# EAGLE design cryoShieldBreakout (EAGLE 7.1.0)
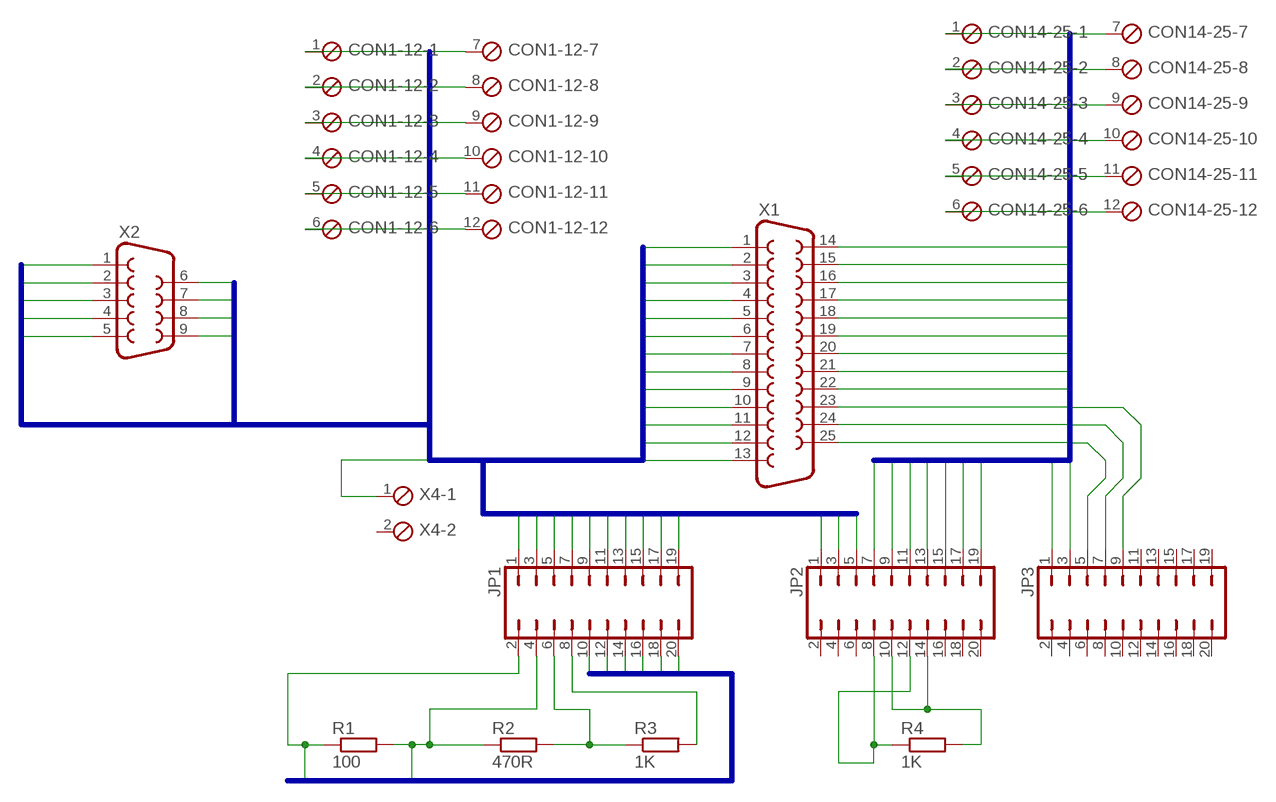
[diagram p0: schematic, sheet 1]

## Parts
CON1-12  MPT12  [12POL254]
CON14-25  MPT12  [12POL254]
JP1  JP10Q  [JP10Q]
JP2  JP10Q  [JP10Q]
JP3  JP10Q  [JP10Q]
R1  100  R-EU_0207/10  [0207/10]
R2  470R  R-EU_0207/10  [0207/10]
R3  1K  R-EU_0207/10  [0207/10]
R4  1K  R-EU_0207/10  [0207/10]
X1  F25H  [F25H]
X2  F09H  [F09H]
X4  MPT2  [2POL254]

## Nets
1: CON1-12.1 JP1.1 X1.1 X2.1
2: CON1-12.2 JP1.3 X1.2 X2.2
3: CON1-12.3 JP1.5 X1.3 X2.3
4: CON1-12.4 JP1.7 X1.4 X2.4
5: CON1-12.5 JP1.9 X1.5 X2.5
6: CON1-12.6 JP1.11 X1.6 X2.6
7: CON1-12.7 JP1.13 X1.7 X2.7
8: CON1-12.8 JP1.15 X1.8 X2.8
9: CON1-12.9 JP1.17 X1.9 X2.9
10: CON1-12.10 JP1.19 X1.10
11: CON1-12.11 JP2.1 X1.11
12: CON1-12.12 JP2.3 X1.12
13: JP2.5 X1.13 X4.1
14: CON14-25.1 JP2.7 X1.14
15: CON14-25.2 JP2.9 X1.15
16: CON14-25.3 JP2.11 X1.16
17: CON14-25.4 JP2.13 X1.17
18: CON14-25.5 JP2.15 X1.18
19: CON14-25.6 JP2.17 X1.19
20: CON14-25.7 JP2.19 X1.20
21: CON14-25.8 JP3.1 X1.21
22: CON14-25.9 JP3.3 X1.22
23: CON14-25.10 JP3.5 X1.23
24: CON14-25.11 JP3.7 X1.24
25: CON14-25.12 JP3.9 X1.25
A1+: JP1.2 JP1.10 R1.1
A1-: JP1.4 R1.2 R2.1
A2+: JP1.12 JP1.14
A3+: JP1.16 JP1.18
A3-: JP1.20
N$2: JP2.8 JP2.12 R4.1
N$3: JP2.10 JP2.14 R4.2
N$6: JP1.6 R2.2 R3.1
N$8: JP1.8 R3.2
Unconnected: JP2.2 JP2.4 JP2.6 JP2.16 JP2.18 JP2.20 JP3.2 JP3.4 JP3.6 JP3.8 JP3.10 JP3.11 JP3.12 JP3.13 JP3.14 JP3.15 JP3.16 JP3.17 JP3.18 JP3.19 JP3.20 X4.2

## Buses
1,2,3,4,5,6,7,8,9,10,11,12,13
14,15,16,17,18,19,20,21,22,23,24,25
A1+,A2+,A3+,A3-

## Library data of the parts
CON1-12 CON14-25 = con-phoenix-254:MPT12: PHOENIX CONNECTOR; OC_FARNELL: unknown; OC_NEWARK: unknown
JP1-JP3 = jumper:JP10Q: JUMPER
R1-R4 = rcl:R-EU_: RESISTOR, European symbol
X1 = con-subd:F25: SUB-D; OC_FARNELL: unknown; OC_NEWARK: unknown
X2 = con-subd:F09: SUB-D; OC_FARNELL: unknown; OC_NEWARK: unknown
X4 = con-phoenix-254:MPT2: PHOENIX CONNECTOR; OC_FARNELL: unknown; OC_NEWARK: unknown

## Board
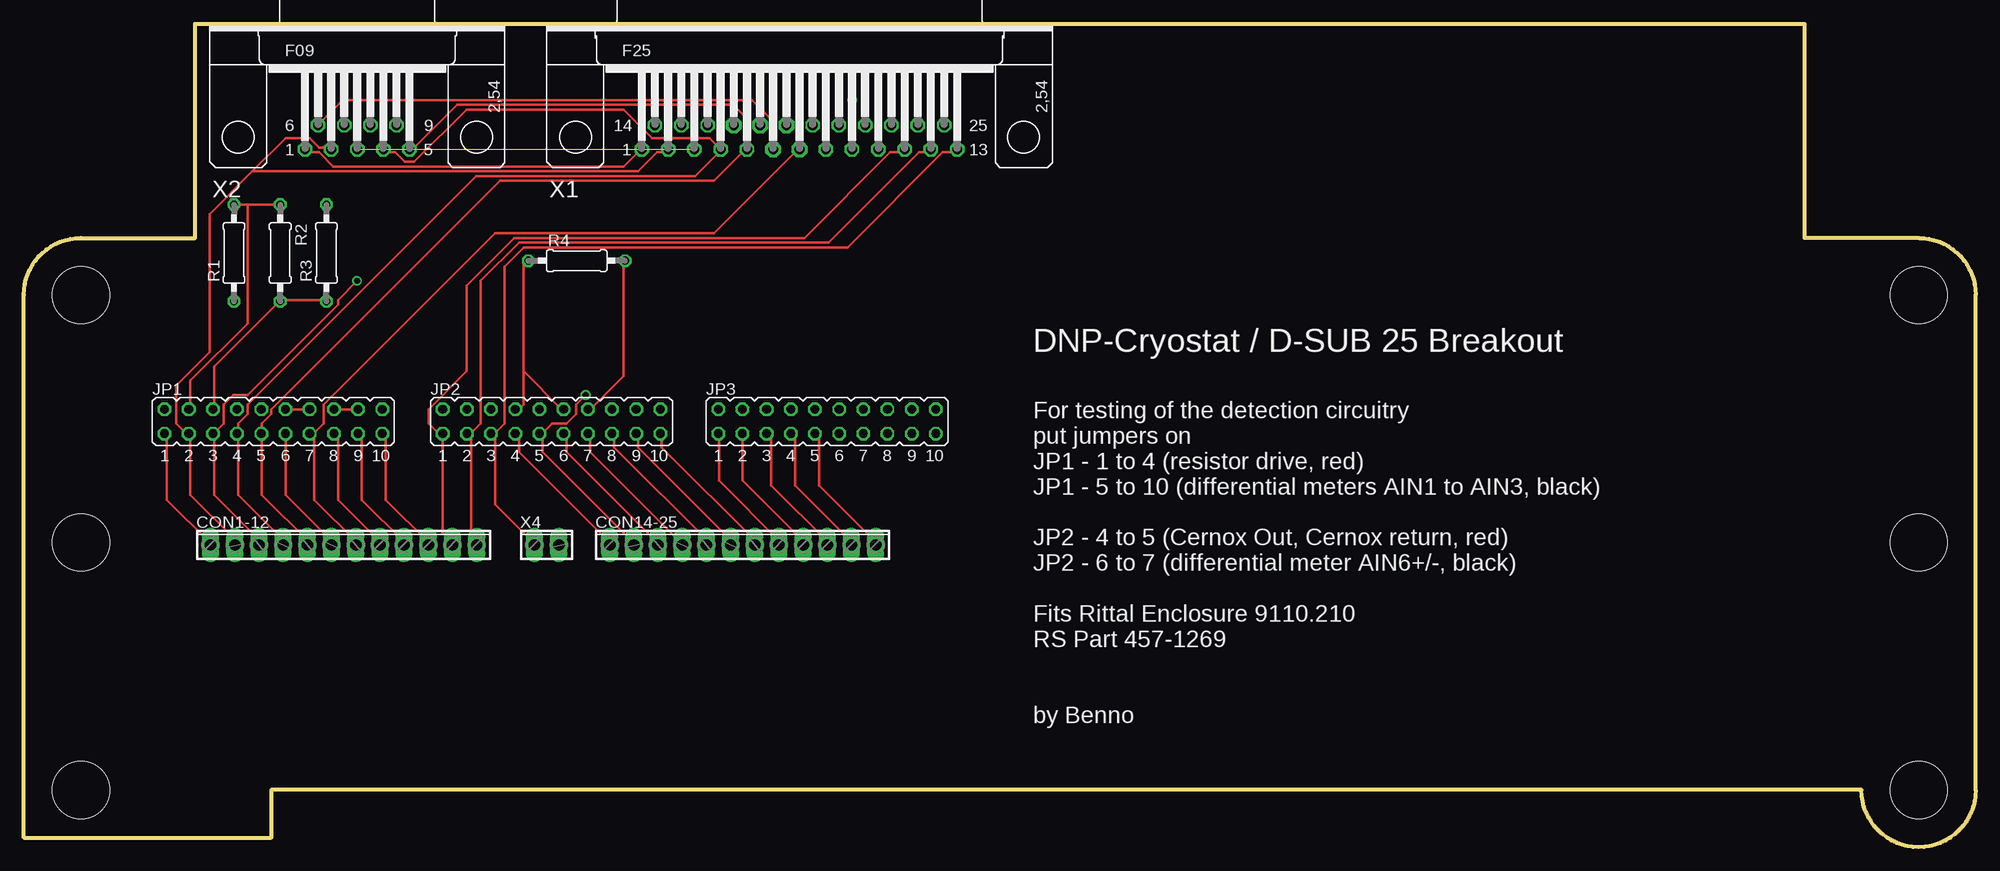
[diagram p1: board, top side]
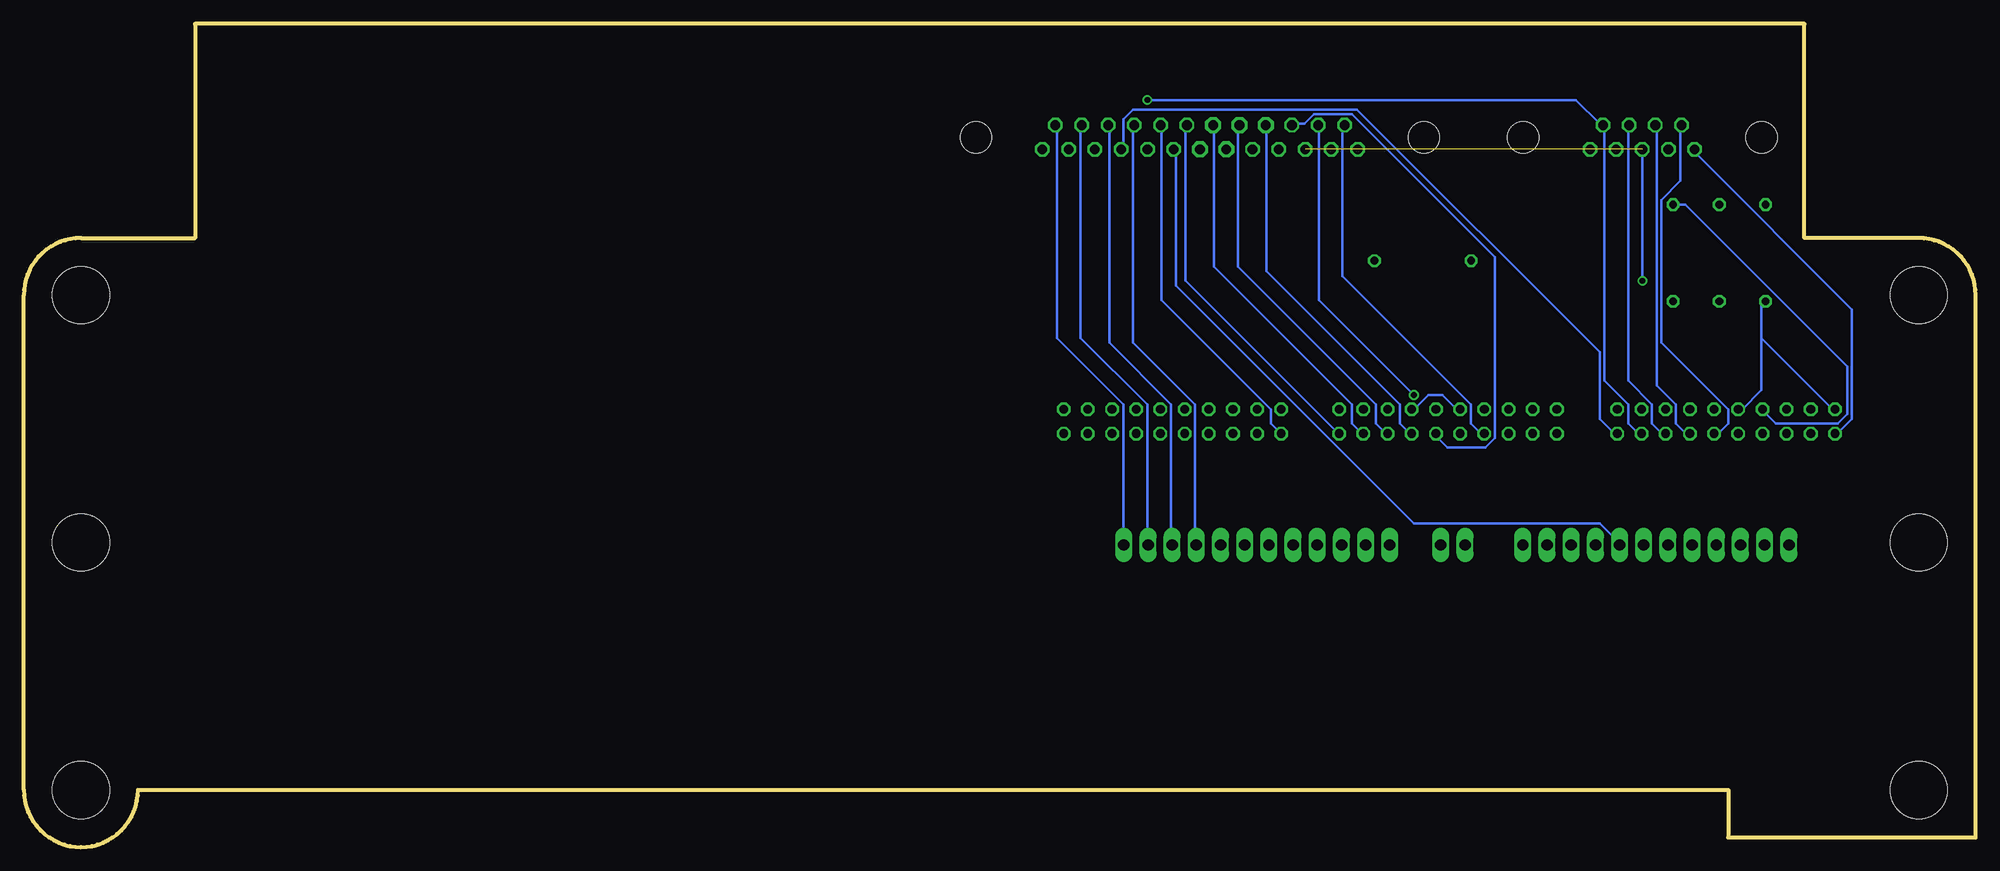
[diagram p2: board, bottom side, seen from below]

Size 205 x 86.5 mm. Coordinates in mm from the lower left corner, seen from the top.
Outline: 18,86.5 187,86.5 187,64 199,64 arc-90 205,58 205,6 arc-180 193,6 26,6 26,1 0,1 0,58 arc-90 6,64 18,64 18,86.5
Copper layers (1*16): Top 0.035mm / dielectric 1.5mm / Bottom 0.035mm
Design rules "default": minimum track width 10mil, minimum drill 24mil, track to track 8mil, track to pad 8mil, pad to pad 8mil, via to via 8mil, smd to smd 8mil, copper to edge 40mil, drill to drill 8mil, minimum pad ring 10mil, minimum via ring 8mil, stop-mask expansion 4mil, vias tented up to drill 0mil, thermal gap 10mil
Holes 6 mm at 6,6 6,58 199,58 199,6 6,32 199,32

### Footprints (pad centres in the part's own frame; a part is rotated, then mirrored left to right if it is on the bottom)
12POL254 = drill 1.2 long: 1 -13.97,0; 2 -11.43,0; 3 -8.89,0; 4 -6.35,0; 5 -3.81,0; 6 -1.27,0; 7 1.27,0; 8 3.81,0; 9 6.35,0; 10 8.89,0; 11 11.43,0; 12 13.97,0
JP10Q = drill 0.914 octagon: 1 -11.43,-1.27; 2 -11.43,1.27; 3 -8.89,-1.27; 4 -8.89,1.27; 5 -6.35,-1.27; 6 -6.35,1.27; 7 -3.81,-1.27; 8 -3.81,1.27; 9 -1.27,-1.27; 10 -1.27,1.27; 11 1.27,-1.27; 12 1.27,1.27; 13 3.81,-1.27; 14 3.81,1.27; 15 6.35,-1.27; 16 6.35,1.27; 17 8.89,-1.27; 18 8.89,1.27; 19 11.43,-1.27; 20 11.43,1.27
0207/10 = drill 0.813 octagon: 1 -5.08,0; 2 5.08,0
F25H = drill 1.016 octagon: 1 -16.561,-1.27; 2 -13.792,-1.27; 3 -11.049,-1.27; 4 -8.28,-1.27; 5 -5.512,-1.27; 8 2.769,-1.27; 9 5.512,-1.27; 10 8.28,-1.27; 11 11.049,-1.27; 12 13.792,-1.27; 13 16.561,-1.27; 14 -15.189,1.27; 15 -12.421,1.27; 16 -9.652,1.27; 20 1.372,1.27; 21 4.14,1.27; 22 6.909,1.27; 23 9.652,1.27; 24 12.421,1.27; 25 15.189,1.27 | drill 1.016 pad 1.67 octagon: 6 -2.769,-1.27; 7 0,-1.27; 17 -6.909,1.27; 18 -4.14,1.27; 19 -1.372,1.27 | hole 3.302: -23.52,0; 23.52,0
F09H = drill 1.016 octagon: 1 -5.486,-1.27; 2 -2.743,-1.27; 3 0,-1.27; 4 2.743,-1.27; 5 5.486,-1.27; 6 -4.115,1.27; 7 -1.372,1.27; 8 1.372,1.27; 9 4.115,1.27 | hole 3.302: -12.522,0; 12.522,0
2POL254 = drill 1.2 long: 1 -1.27,0; 2 1.27,0

### Placement (x,y rotation side)
CON1-12  33.59,31.75 0 top
CON14-25  75.5,31.75 0 top
JP1  26.21,44.72 0 top
JP2  55.42,44.72 0 top
JP3  84.36,44.72 0 top
R1  22.08,62.42 90 top
R2  26.93,62.42 270 top
R3  31.78,62.42 90 top
R4  58.07,61.61 0 top
X1  81.47,74.58 0 top
X2  35.02,74.58 0 top
X4  54.91,31.75 0 top

### Tracks (layer width: path | path; a pad name or v marks a point on that pad's centre or on a via)
1
  Top 0.254: JP1.1 15,43 15,36.5 19.5,32 CON1-12.1 | X2.1 30,73 31,73 32.5,71.5 63,71.5 64.5,73 X1.1
  Bottom 0.254: JP1.1 14.5,43.5 13,45 13,56.5 29.5,73 X2.1
2
  Top 0.254: CON1-12.2 22.5,32 17.5,37 17.5,43 JP1.3 17,43.5 16,44.5 16,48.5 19.5,52 19.5,66.5 24,71 | 24,71 27.5,74.5 30,74.5 31,73.5 32,73.5 X2.2 | 24,71 64.5,71 66.5,73 67.5,73 X1.2
3  (via drill 0.61)  (1 unrouted)
  Top 0.254: CON1-12.3 25,32 20,37 20,43 JP1.5 20,43.5 21,44.5 21,46.5 22,47.5 23.5,47.5 33,57 33,57.5 v35,59.5
  Bottom 0.254: v35,59.5 35,73 X2.3
4
  Top 0.254: CON1-12.4 27.5,32 22.5,37 22.5,43 JP1.7 22.5,43.5 22.5,44.5 23.5,45.5 23.5,46.5 47.5,70.5 70.5,70.5 73,73 X1.4 73,73.5 72,74.5 66,74.5 63,77.5 46.5,77.5 41,72 40,72 39,73 38,73 X2.4
5
  Top 0.254: CON1-12.5 30,32 25,37 25,43 JP1.9 25,43.5 25,44.5 26,45.5 26,46 50,70 72.5,70 75.5,73 X1.5 76,73.5 76,76.5 74.5,78 45.5,78 41,73.5 X2.5
6
  Top 0.254: JP1.11 27.5,43 27.5,37 32.5,32 CON1-12.6 | X1.6 78.5,73.5 78.5,76.5 76.5,78.5 33.5,78.5 31,76 X2.6
  Bottom 0.254: X2.6 31,75.5 31,70 33,68 33,53 26,46 26,44.5 27,43.5 JP1.11
7
  Top 0.254: CON1-12.7 35,32 30.5,36.5 30.5,43 JP1.13 30.5,43.5 31.5,44.5 31.5,46.5 49.5,64.5 72.5,64.5 81,73 X1.7
  Bottom 0.254: X2.7 33.5,75.5 33.5,48.5 31.5,46.5 31.5,44.5 30.5,43.5 JP1.13
8
  Top 0.254: JP1.15 33,43 33,36.5 37.5,32 CON1-12.8
  Bottom 0.254: X2.8 36.5,75.5 36.5,49 34,46.5 34,44.5 33,43.5 JP1.15 | X1.8 84,73 84,59 59,34 39.5,34 37.5,32 CON1-12.8
9  (via drill 0.61)
  Top 0.254: JP1.17 35.5,43 35.5,36.5 40,32 CON1-12.9 | v87,78.5 87,73.5 X1.9
  Bottom 0.254: JP1.17 35.5,43.5 36.5,44.5 36.5,46.5 39,49 39,75.5 X2.9 39.5,76 42,78.5 v87,78.5
10
  Top 0.254: JP1.19 38,43 38,36.5 42.5,32 CON1-12.10
  Bottom 0.254: X1.10 89.5,73.5 89.5,76.5 88.5,77.5 65,77.5 39.5,52 39.5,45 38,43.5 JP1.19
11
  Top 0.254: CON1-12.11 45,32 44,33 44,43 JP2.1 43.5,43.5 42.5,44.5 42.5,46 46.5,50 46.5,59 51.5,64 82,64 91,73 92.5,73 X1.11
12
  Top 0.254: CON1-12.12 47.5,32 47,32.5 47,43 JP2.3 47,43.5 48,44.5 48,59.5 52,63.5 84.5,63.5 94,73 95,73 X1.12
13
  Top 0.254: X4.1 53.5,32 49.5,36 49.5,43 JP2.5 49.5,43.5 50.5,44.5 50.5,61 52.5,63 86.5,63 96.5,73 98,73 X1.13
14
  Top 0.254: JP2.7 52,43 52,41.5 61.5,32 CON14-25.1
  Bottom 0.254: X1.14 66.5,75.5 66.5,60 53,46.5 53,44.5 52,43.5 JP2.7
15  (via drill 0.61)
  Top 0.254: CON14-25.2 64,32 54.5,41.5 54.5,43 JP2.9 54.5,43.5 55.5,44.5 57,44.5 58,45.5 58,46.5 v59,47.5
  Bottom 0.254: v59,47.5 69,57.5 69,75.5 X1.15
16
  Top 0.254: JP2.11 57,43 57,41.5 66.5,32 CON14-25.3
  Bottom 0.254: X1.16 71.5,76 70.5,76 69.5,77 65.5,77 50.5,62 50.5,43 51.5,42 55.5,42 56.5,43 JP2.11
17
  Top 0.254: JP2.13 59.5,43 59.5,41.5 69,32 CON14-25.4
  Bottom 0.254: X1.17 74.5,75.5 74.5,60.5 60.5,46.5 60.5,44.5 59.5,43.5 JP2.13
18
  Top 0.254: JP2.15 62,43 62,42 72,32 CON14-25.5
  Bottom 0.254: X1.18 77.5,75.5 77.5,61 63,46.5 63,44.5 62,43.5 JP2.15
19
  Top 0.254: JP2.17 64.5,43 64.5,42 74.5,32 CON14-25.6
  Bottom 0.254: X1.19 80,75.5 80,61 65.5,46.5 65.5,44.5 64.5,43.5 JP2.17
20
  Top 0.254: JP2.19 67,43 67,42 77,32 CON14-25.7
  Bottom 0.254: X1.20 83,75.5 83,59.5 67,43.5 JP2.19
21
  Top 0.254: JP3.1 73,43 73,38.5 79.5,32 CON14-25.8
  Bottom 0.254: X1.21 85.5,75.5 85.5,57.5 74,46 74,44.5 73,43.5 JP3.1
22
  Top 0.254: JP3.3 75.5,43 75.5,38.5 82,32 CON14-25.9
  Bottom 0.254: X1.22 88.5,75.5 88.5,53 82,46.5 82,32 CON14-25.9
23
  Top 0.254: JP3.5 78.5,43 78.5,38 84.5,32 CON14-25.10
  Bottom 0.254: X1.23 91,75.5 91,53 84.5,46.5 84.5,32 CON14-25.10
24
  Top 0.254: JP3.7 81,43 81,38 87,32 CON14-25.11
  Bottom 0.254: X1.24 94,75.5 94,53.5 87,46.5 87,32 CON14-25.11
25
  Top 0.254: JP3.9 83.5,43 83.5,38 89.5,32 CON14-25.12
  Bottom 0.254: X1.25 96.5,75.5 96.5,53.5 89.5,46.5 89.5,32 CON14-25.12
A1+
  Bottom 0.254: 22.5,53.5 22.5,48 24.5,46 JP1.10 | 22.5,53.5 22.5,57 R1.1 | 22.5,53.5 15,46 JP1.2
A1-
  Top 0.254: R2.1 23.5,67.5 | 23.5,67.5 R1.2 | 23.5,67.5 23.5,55 17.5,49 17.5,46 JP1.4
A2+
  Top 0.254: JP1.12 27.5,46 30,46 JP1.14
A3+
  Top 0.254: JP1.16 33,46 35,46 JP1.18
N$2
  Top 0.254: 52.5,50 52.5,46.5 52,46 JP2.8 | 52.5,50 52.5,61.5 R4.1 | 52.5,50 56.5,46 JP2.12
N$3
  Top 0.254: R4.2 63,61.5 63,49.5 59.5,46 JP2.14
  Bottom 0.254: JP2.10 54.5,46 56,47.5 57.5,47.5 59,46 JP2.14
N$6
  Top 0.254: R3.1 31.5,57.5 27,57.5 R2.2 26.5,57 20,50.5 20,46 JP1.6
N$8
  Bottom 0.254: R3.2 30.5,67.5 13.5,50.5 13.5,45.5 14.5,44.5 21,44.5 22,45.5 JP1.8

### Text on the board
Dimension: x symmetry point at 105.5
tPlace: DNP-Cryostat / D-SUB 25 Breakout | For testing of the detection circuitry / put jumpers on / JP1 - 1 to 4 (resistor drive, red) / JP1 - 5 to 10 (differential meters AIN1 to AIN3, black) / / JP2 - 4 to 5 (Cernox Out, Cernox return, red) / JP2 - 6 to 7 (differential meter AIN6+/-, black) / / Fits Rittal Enclosure 9110.210 / RS Part 457-1269 / / / by Benno